# EAGLE design Schematic1 (EAGLE 8.4.2)
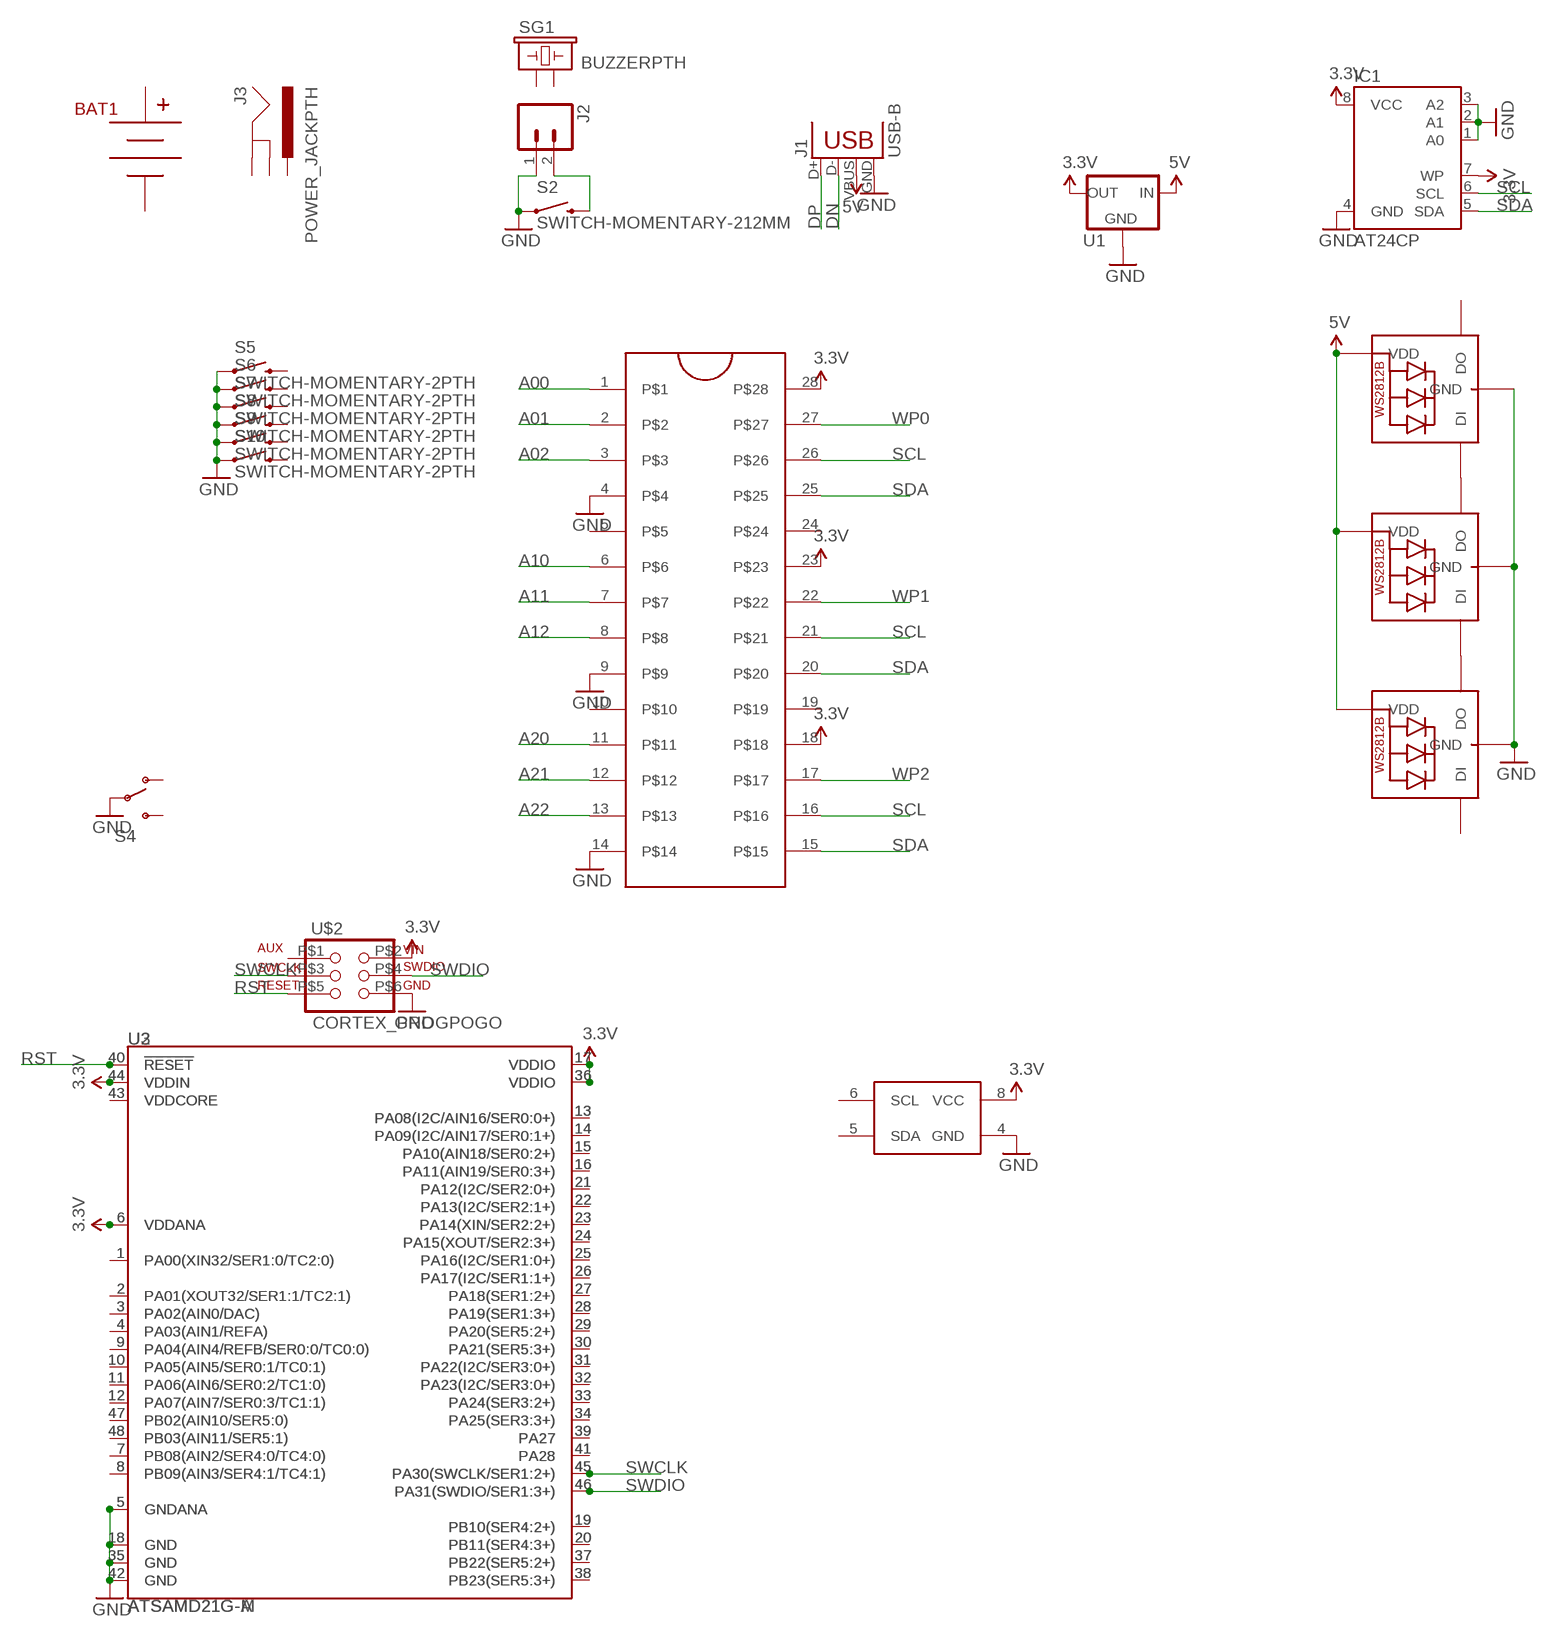
[diagram p0: schematic, sheet 1]

## Parts
BAT1  9VHOLDERCLIPS  [BSPC9V]
IC1  AT24CP  [DIL08]
J1  USB-B  USBPTH  [USB-B-PTH]
J2  M02PTH3  [1X02_LONGPADS]
J3  POWER_JACKPTH  [POWER_JACK_PTH]
LED1  WS2812B5050  [WS2812B]
LED2  WS2812B5050  [WS2812B]
LED3  WS2812B5050  [WS2812B]
S2  SWITCH-MOMENTARY-212MM  [TACTILE-PTH-12MM]
S4  SWITCH-SPDTPTH  [SWITCH-SPDT]
S5  SWITCH-MOMENTARY-2PTH  [TACTILE-PTH]
S6  SWITCH-MOMENTARY-2PTH  [TACTILE-PTH]
S7  SWITCH-MOMENTARY-2PTH  [TACTILE-PTH]
S8  SWITCH-MOMENTARY-2PTH  [TACTILE-PTH]
S9  SWITCH-MOMENTARY-2PTH  [TACTILE-PTH]
S10  SWITCH-MOMENTARY-2PTH  [TACTILE-PTH]
SG1  BUZZERPTH  [BUZZER-12MM]
U1  V_REG_78XXTO-92_UNTESTED  [TO-92]
U2  ATSAMD21G-A  [TQFP-48]
U3  ATSAMD21G-M  [QFN-48]
U4  ATSHA204_I2C-SSHDA-*  [SOIC-08]
U$1  ZIFSOCKET-28-3ZIFFSOCKET-28-3  [DIL28-3-ZIF_SOCKET]
U$2  CORTEX_PROGPOGO  [2X3_MAX]

## Nets
3.3V: IC1.7(WP) IC1.8(VCC) U1.1(OUT) U2.6(VDDANA) U2.17(VDDIO) U2.36(VDDIO) U2.44(VDDIN) U3.6(VDDANA) U3.17(VDDIO) U3.36(VDDIO) U3.44(VDDIN) U4.8(VCC) U$1.18 U$1.23 U$1.28 U$2.P$2(VIN)
5V: J1.VBUS LED1.1-VDD(VDD) LED2.1-VDD(VDD) LED3.1-VDD(VDD) U1.3(IN)
A00: U$1.1
A01: U$1.2
A02: U$1.3
A10: U$1.6
A11: U$1.7
A12: U$1.8
A20: U$1.11
A21: U$1.12
A22: U$1.13
DN: J1.D-
DP: J1.D+
GND: IC1.1(A0) IC1.2(A1) IC1.3(A2) IC1.4(GND) J1.GND J2.1 LED1.3-GND(GND) LED2.3-GND(GND) LED3.3-GND(GND) S2.1 S2.2 S4.2(P) S5.1 S5.2 S6.1 S6.2 S7.1 S7.2 S8.1 S8.2 S9.1 S9.2 S10.1 S10.2 U1.2(GND) U2.5(GNDANA) U2.18(GND) U2.35(GND) U2.42(GND) U3.5(GNDANA) U3.18(GND) U3.35(GND) U3.42(GND) U4.4(GND) U$1.4 U$1.9 U$1.14 U$2.P$6(GND)
N$1: LED1.4-DIN(DI) LED2.2-DOUT(DO)
N$2: LED2.4-DIN(DI) LED3.2-DOUT(DO)
N$4: U2.1(PA00(XIN32/SER1:0/TC2:0)) U3.1(PA00(XIN32/SER1:0/TC2:0))
N$5: U2.2(PA01(XOUT32/SER1:1/TC2:1)) U3.2(PA01(XOUT32/SER1:1/TC2:1))
N$6: U2.3(PA02(AIN0/DAC)) U3.3(PA02(AIN0/DAC))
N$7: U2.4(PA03(AIN1/REFA)) U3.4(PA03(AIN1/REFA))
N$8: U2.11(PA06(AIN6/SER0:2/TC1:0)) U3.11(PA06(AIN6/SER0:2/TC1:0))
N$10: U2.7(PB08(AIN2/SER4:0/TC4:0)) U3.7(PB08(AIN2/SER4:0/TC4:0))
N$11: U2.8(PB09(AIN3/SER4:1/TC4:1)) U3.8(PB09(AIN3/SER4:1/TC4:1))
N$12: U2.9(PA04(AIN4/REFB/SER0:0/TC0:0)) U3.9(PA04(AIN4/REFB/SER0:0/TC0:0))
N$13: U2.10(PA05(AIN5/SER0:1/TC0:1)) U3.10(PA05(AIN5/SER0:1/TC0:1))
N$14: U2.12(PA07(AIN7/SER0:3/TC1:1)) U3.12(PA07(AIN7/SER0:3/TC1:1))
N$15: U2.13(PA08(I2C/AIN16/SER0:0+)) U3.13(PA08(I2C/AIN16/SER0:0+))
N$16: U2.15(PA10(AIN18/SER0:2+)) U3.15(PA10(AIN18/SER0:2+))
N$17: U2.14(PA09(I2C/AIN17/SER0:1+)) U3.14(PA09(I2C/AIN17/SER0:1+))
N$18: U2.16(PA11(AIN19/SER0:3+)) U3.16(PA11(AIN19/SER0:3+))
N$19: J2.2 S2.3 S2.4
N$21: U2.20(PB11(SER4:3+)) U3.20(PB11(SER4:3+))
N$22: U2.19(PB10(SER4:2+)) U3.19(PB10(SER4:2+))
N$23: U2.21(PA12(I2C/SER2:0+)) U3.21(PA12(I2C/SER2:0+))
N$24: U2.22(PA13(I2C/SER2:1+)) U3.22(PA13(I2C/SER2:1+))
N$25: U2.23(PA14(XIN/SER2:2+)) U3.23(PA14(XIN/SER2:2+))
N$26: U2.24(PA15(XOUT/SER2:3+)) U3.24(PA15(XOUT/SER2:3+))
N$27: U2.25(PA16(I2C/SER1:0+)) U3.25(PA16(I2C/SER1:0+))
N$28: U2.26(PA17(I2C/SER1:1+)) U3.26(PA17(I2C/SER1:1+))
N$29: U2.27(PA18(SER1:2+)) U3.27(PA18(SER1:2+))
N$30: U2.28(PA19(SER1:3+)) U3.28(PA19(SER1:3+))
N$31: U2.29(PA20(SER5:2+)) U3.29(PA20(SER5:2+))
N$32: U2.30(PA21(SER5:3+)) U3.30(PA21(SER5:3+))
N$33: U2.31(PA22(I2C/SER3:0+)) U3.31(PA22(I2C/SER3:0+))
N$34: U2.32(PA23(I2C/SER3:0+)) U3.32(PA23(I2C/SER3:0+))
N$35: U2.33(PA24(SER3:2+)) U3.33(PA24(SER3:2+))
N$36: U2.34(PA25(SER3:3+)) U3.34(PA25(SER3:3+))
N$39: U2.37(PB22(SER5:2+)) U3.37(PB22(SER5:2+))
N$40: U2.38(PB23(SER5:3+)) U3.38(PB23(SER5:3+))
N$41: U2.39(PA27) U3.39(PA27)
N$43: U2.41(PA28) U3.41(PA28)
N$45: U2.43(VDDCORE) U3.43(VDDCORE)
N$49: U2.47(PB02(AIN10/SER5:0)) U3.47(PB02(AIN10/SER5:0))
N$50: U2.48(PB03(AIN11/SER5:1)) U3.48(PB03(AIN11/SER5:1))
RST: U2.40(!RESET!) U3.40(!RESET!) U$2.P$5(RST)
SCL: IC1.6(SCL) U$1.16 U$1.21 U$1.26
SDA: IC1.5(SDA) U$1.15 U$1.20 U$1.25
SWCLK: U2.45(PA30(SWCLK/SER1:2+)) U3.45(PA30(SWCLK/SER1:2+)) U$2.P$3(SWCLK)
SWDIO: U2.46(PA31(SWDIO/SER1:3+)) U3.46(PA31(SWDIO/SER1:3+)) U$2.P$4(SWDIO)
WP0: U$1.27
WP1: U$1.22
WP2: U$1.17
Unconnected: BAT1.P$1(V-) BAT1.P$2(V-) BAT1.P$3(V-) BAT1.P$4(V+) BAT1.P$5(V+) BAT1.P$6(V+) J3.GND J3.GNDBREAK J3.PWR LED1.2-DOUT(DO) LED3.4-DIN(DI) S4.1(O) S4.3(S) S5.3 S5.4 S6.3 S6.4 S7.3 S7.4 S8.3 S8.4 S9.3 S9.4 S10.3 S10.4 SG1.+ SG1.- U4.5(SDA) U4.6(SCL) U$1.5 U$1.10 U$1.19 U$1.24 U$2.P$1(AUX)

## Library data of the parts
BAT1 = maxorig:9VHOLDER: 9V board-mount battery cradle
IC1 = atmel:AT24C*: 2-wire serial EEPROM; MPN: AT24C1024BW-SH-B; OC_FARNELL: 1362646; OC_NEWARK: 03P2044
J1 = SparkFun-Connectors:USB: USB Connectors USB-B-PTH is fully proven SKU : PRT-00139/CONN-08278 USB-miniB is fully proven SKU : PRT-00587 USB-A-PCB is untested. USB-A-H is throughly reviewed, but untested. Spark Fun Electronics SKU : PRT-00437 USB-B-SMT is throughly reviewed, but untested. Needs silkscreen touching up. USB-A-S has not been used/tested USB-MB-H has not been used/tested USB-MICROB has been used. CONN-09505; PROD_ID: CONN-08278
J2 = SparkFun-Connectors:M02: Standard 2-pin 0.1" header. Use with - straight break away headers ( PRT-00116) - right angle break away headers (PRT-00553) - swiss pins (PRT-00743) - machine pins (PRT-00117) - female headers (PRT-00115) Molex polarized connector foot print use with: PRT-08233 with associated crimp pins and housings. 2.54_SCREWTERM for use with PRT-10571. 3.5mm Screw Terminal footprints for PRT-08084 5mm Screw Terminal footprints for use with PRT-08432
J3 = SparkFun-Connectors:POWER_JACK: Power Jack This is the standard 5.5mm barrel jack for power. The PTH is the most common, proven, reliable, footprint. The Slot footprint only works if the mill layer is transmitted to the PCB fab house so be warned. Mating wall wart : TOL-00298 (and others); PROD_ID: CONN-08197
LED1-LED3 = adafruit:WS2812B
S2 = maxorig:SWITCH-MOMENTARY-2: Various NO switches- pushbuttons, reed, etc; PROD_ID: SWCH-09185
S4 = SparkFun-Electromechanical:SWITCH-SPDT: SPDT Switch Simple slide switch, Spark Fun Electronics SKU : COM-00102 DPDT SMT slide switch, AYZ0202, SWCH-08179; PROD_ID: SWCH-08261
S5-S10 = maxorig:SWITCH-MOMENTARY-2: Various NO switches- pushbuttons, reed, etc; PROD_ID: SWCH-08441
SG1 = SparkFun-Electromechanical:BUZZER: Buzzer 12mm Spark Fun Electronics SKU : Comp-Buzzer
U1 = SparkFun-PowerIC:V_REG_78XX: Voltage Regulator Standard 78xx regulator. IGO (Input Ground Output). Spark Fun Electronics SKU : COM-00107
U2 U3 = SparkFun-DigitalIC:ATSAMD21G: Atmel SAMD21G SMART ARM-Based Microcontroller The Atmel ® | SMART ™ SAM D21 is a series of low-power microcontrollers using the 32-bit ARM ® Cortex ® -M0+ processor, and ranging from 32- to 64-pins with up to 256KB Flash and 32KB of SRAM. The SAM D21 devices operate at a maximum frequency of 48MHz and reach 2.46 CoreMark/MHz. They are designed for simple and intuitive migration with identical peripheral modules, hex compatible code, identical linear address map and pin compatible migration paths between all devices in the product series. All devices include intelligent and flexible peripherals, Atmel Event System for inter-peripheral signaling, and support for capacitive touch button, slider and wheel user interfaces.; PROD_ID: IC-13064
U4 = maxorig:ATSHA204_I2C: ATSHA204 I2C - Atmel Crypto Element w/ 4.5Kb EEPROM The Atmel ATSHA204 is an optimized authentication chip that includes a 4.5Kb EEPROM. This array can be used for storage of keys, miscellaneous read/write, read-only, password or secret data, and consumption tracking. Access to the various sections of memory can be restricted in a variety of ways and then the configuration locked to prevent changes. This part is for the I2C version of the ATSHA204A. Technical specifications: Supply voltage: 2.0-5.5V Communication voltage: 1.8-5.5V 512 bit OTP (One Time Programmable) region Guaranteed unique 72-bit serial number Internal, high-quality RNG (Random Number Generator) Hardware SHA-256 accelerator
U$1 = SparkFun-Connectors:ZIFSOCKET-28-3: Lever-action ZIF socket for 28-pin ICs
U$2 = maxorig:CORTEX_PROG: 2x3 0.1' connector for programming and debugging Cortex M0(+) MCUs Has auxiliary pin broken out for extra testing functionality

## Board
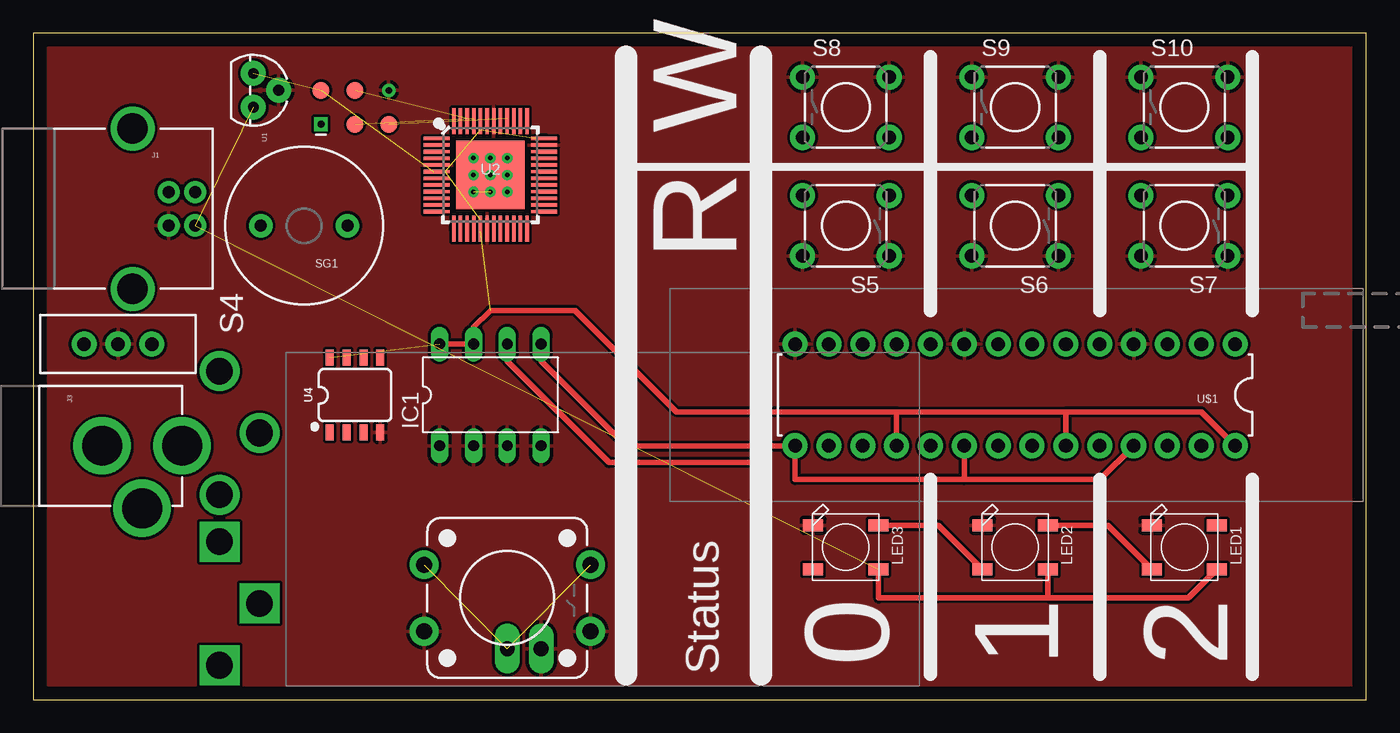
[diagram p1: board, top side]
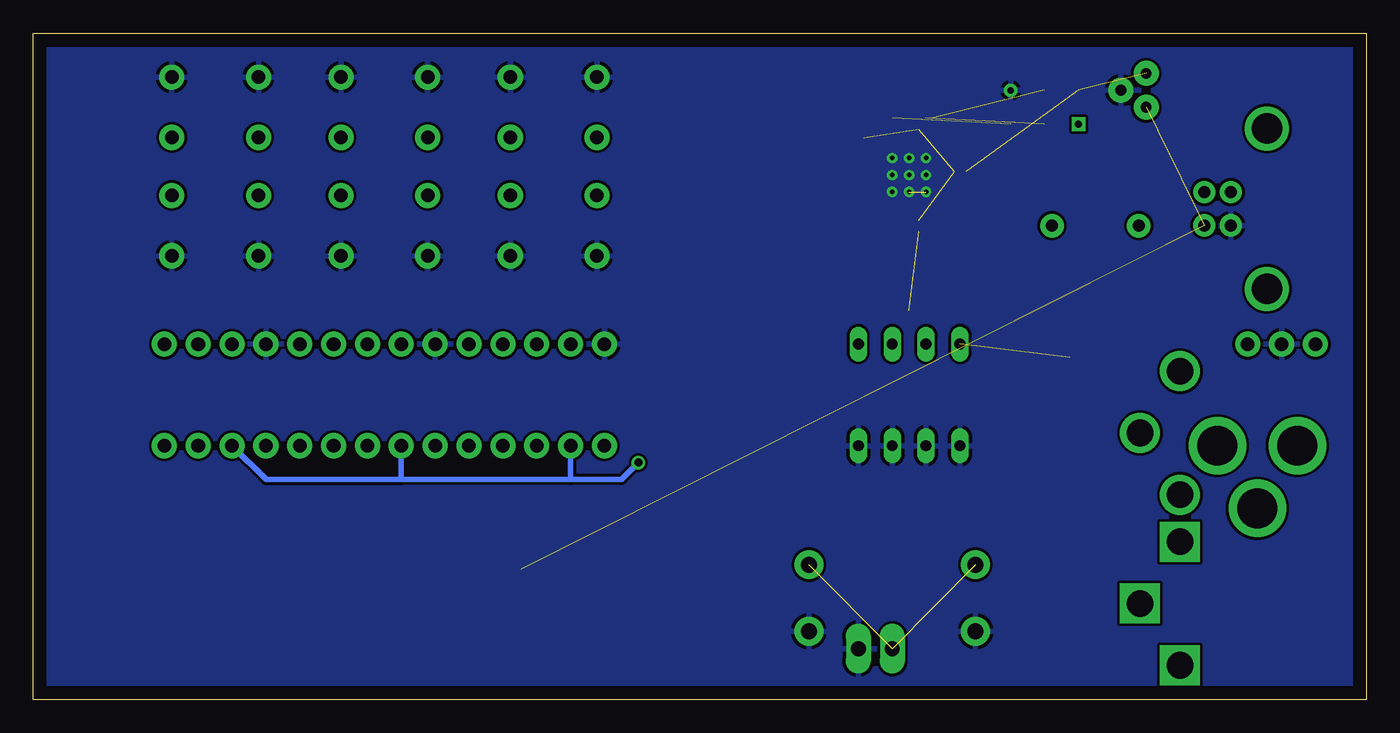
[diagram p2: board, bottom side, seen from below]

Size 100 x 50 mm. Coordinates in mm from the lower left corner, seen from the top.
Outline: 0,0 100,0 100,50 0,50 0,0
Copper layers (1*16): Top 0.035mm / dielectric 1.5mm / Bottom 0.035mm
Design rules "default": minimum track width 10mil, minimum drill 24mil, track to track 8mil, track to pad 8mil, pad to pad 8mil, via to via 8mil, smd to smd 8mil, copper to edge 40mil, drill to drill 8mil, minimum pad ring 10mil, minimum via ring 8mil, stop-mask expansion 4mil, vias tented up to drill 0mil, thermal gap 10mil

### Footprints (pad centres in the part's own frame; a part is rotated, then mirrored left to right if it is on the bottom)
BSPC9V = drill 2: P$1 0,22.1; P$2 0,12.83; P$3 3,17.465 | drill 2 square: P$4 0,9.3; P$5 0,0.03; P$6 3,4.665
DIL08 = drill 0.813 long: 1 -3.81,-3.81; 2 -1.27,-3.81; 3 1.27,-3.81; 4 3.81,-3.81; 5 3.81,3.81; 6 1.27,3.81; 7 -1.27,3.81; 8 -3.81,3.81
USB-B-PTH = drill 0.914 pad 1.676: D+ 0,1.25; D- 1.981,1.25; GND 0,-1.25; VBUS 1.981,-1.25 | drill 2.286: S1 -2.718,-6.02; S2 -2.718,6.02
1X02_LONGPADS = drill 1.118 pad 1.88 long: 1 0,0; 2 2.54,0
POWER_JACK_PTH = drill 2.997 pad 4.318: GND 0,7.7; GNDBREAK 4.7,10.7; PWR 0,13.7
WS2812B = smd 1.5 x 0.9: 1-VDD 2.45,-1.65; 2-DOUT 2.45,1.65; 3-GND -2.45,1.65; 4-DIN -2.45,-1.65
TACTILE-PTH-12MM = drill 1.2 pad 2.159: 1 6.25,-2.5; 2 -6.25,-2.5; 3 6.25,2.5; 4 -6.25,2.5
SWITCH-SPDT = drill 1.016 pad 1.88: 1 0,2.54; 2 0,0; 3 0,-2.54
TACTILE-PTH = drill 1.016 pad 1.88: 1 -3.251,2.261; 2 3.251,2.261; 3 -3.251,-2.261; 4 3.251,-2.261
BUZZER-12MM = drill 0.9 pad 1.778: + 3.25,0; - -3.25,0
TO-92 = drill 0.813 pad 1.88: 1 -1.27,0; 2 0,1.905; 3 1.27,0
TQFP-48 = smd 1.5 x 0.28: 1 -4.25,2.75; 2 -4.25,2.25; 3 -4.25,1.75; 4 -4.25,1.25; 5 -4.25,0.75; 6 -4.25,0.25; 7 -4.25,-0.25; 8 -4.25,-0.75; 9 -4.25,-1.25; 10 -4.25,-1.75; 11 -4.25,-2.25; 12 -4.25,-2.75; 25 4.25,-2.75; 26 4.25,-2.25; 27 4.25,-1.75; 28 4.25,-1.25; 29 4.25,-0.75; 30 4.25,-0.25; 31 4.25,0.25; 32 4.25,0.75; 33 4.25,1.25; 34 4.25,1.75; 35 4.25,2.25; 36 4.25,2.75 | smd 0.28 x 1.5: 13 -2.75,-4.25; 14 -2.25,-4.25; 15 -1.75,-4.25; 16 -1.25,-4.25; 17 -0.75,-4.25; 18 -0.25,-4.25; 19 0.25,-4.25; 20 0.75,-4.25; 21 1.25,-4.25; 22 1.75,-4.25; 23 2.25,-4.25; 24 2.75,-4.25; 37 2.75,4.25; 38 2.25,4.25; 39 1.75,4.25; 40 1.25,4.25; 41 0.75,4.25; 42 0.25,4.25; 43 -0.25,4.25; 44 -0.75,4.25; 45 -1.25,4.25; 46 -1.75,4.25; 47 -2.25,4.25; 48 -2.75,4.25
QFN-48 = smd 0.7 x 0.25: 1 -3.4,2.75; 2 -3.4,2.25; 3 -3.4,1.75; 4 -3.4,1.25; 5 -3.4,0.75; 6 -3.4,0.25; 7 -3.4,-0.25; 8 -3.4,-0.75; 9 -3.4,-1.25; 10 -3.4,-1.75; 11 -3.4,-2.25; 12 -3.4,-2.75; 25 3.4,-2.75; 26 3.4,-2.25; 27 3.4,-1.75; 28 3.4,-1.25; 29 3.4,-0.75; 30 3.4,-0.25; 31 3.4,0.25; 32 3.4,0.75; 33 3.4,1.25; 34 3.4,1.75; 35 3.4,2.25; 36 3.4,2.75 | smd 0.25 x 0.7: 13 -2.75,-3.4; 14 -2.25,-3.4; 15 -1.75,-3.4; 16 -1.25,-3.4; 17 -0.75,-3.4; 18 -0.25,-3.4; 19 0.25,-3.4; 20 0.75,-3.4; 21 1.25,-3.4; 22 1.75,-3.4; 23 2.25,-3.4; 24 2.75,-3.4; 37 2.75,3.4; 38 2.25,3.4; 39 1.75,3.4; 40 1.25,3.4; 41 0.75,3.4; 42 0.25,3.4; 43 -0.25,3.4; 44 -0.75,3.4; 45 -1.25,3.4; 46 -1.75,3.4; 47 -2.25,3.4; 48 -2.75,3.4 | smd 5.15 x 5.15: EP 0,0
SOIC-08 = smd 0.6 x 1.2: 1 -1.905,-2.8; 2 -0.635,-2.8; 3 0.635,-2.8; 4 1.905,-2.8; 5 1.905,2.8; 6 0.635,2.8; 7 -0.635,2.8; 8 -1.905,2.8
DIL28-3-ZIF_SOCKET = drill 1.016 pad 1.88: 1 -16.51,-3.81; 2 -13.97,-3.81; 3 -11.43,-3.81; 4 -8.89,-3.81; 5 -6.35,-3.81; 6 -3.81,-3.81; 7 -1.27,-3.81; 8 1.27,-3.81; 9 3.81,-3.81; 10 6.35,-3.81; 11 8.89,-3.81; 12 11.43,-3.81; 13 13.97,-3.81; 14 16.51,-3.81; 15 16.51,3.81; 16 13.97,3.81; 17 11.43,3.81; 18 8.89,3.81; 19 6.35,3.81; 20 3.81,3.81; 21 1.27,3.81; 22 -1.27,3.81; 23 -3.81,3.81; 24 -6.35,3.81; 25 -8.89,3.81; 26 -11.43,3.81; 27 -13.97,3.81; 28 -16.51,3.81
2X3_MAX = drill 0.508 square: P$1 -2.54,-1.27 | smd 1.27 x 1.27: P$2 -2.54,1.27; P$3 0,-1.27; P$4 0,1.27; P$5 2.54,-1.27 | drill 0.508: P$6 2.54,1.27

### Placement (x,y rotation side)
BAT1  13.97,2.54 0 top
IC1  34.29,22.86 0 top
J1  10.16,36.83 0 top
J2  38.1,3.81 180 top
J3  -2.54,19.05 270 top
LED1  86.36,11.43 0 top
LED2  73.66,11.43 0 top
LED3  60.96,11.43 0 top
S2  35.56,7.62 0 top
S4  6.35,26.67 270 top
S5  60.96,35.56 180 top
S6  73.66,35.56 180 top
S7  86.36,35.56 180 top
S8  60.96,44.45 0 top
S9  73.66,44.45 0 top
S10  86.36,44.45 0 top
SG1  20.32,35.56 180 top
U1  16.51,45.72 270 top
U2  34.29,39.37 0 top
U3  34.29,39.37 0 top
U4  24.13,22.86 0 top
U$1  73.66,22.86 180 top
U$2  24.13,44.45 0 top

### Tracks (layer width: path | path; a pad name or v marks a point on that pad's centre or on a via)
3.3V  (7 unrouted)
  Top 0.254: U2.36 U3.36 | U3.17 U2.17 | U2.6 U3.6 | U3.44 U2.44
  Top 0.406: U$1.28 87.63,21.59 77.47,21.59 | 77.47,21.59 U$1.23 | 64.77,21.59 77.47,21.59 | 64.77,21.59 48.26,21.59 40.64,29.21 34.29,29.21 33.02,27.94 IC1.7 IC1.8 | U$1.18 64.77,21.59
5V  (2 unrouted)
  Top 0.406: LED1.1-VDD 86.65,7.62 76.2,7.62 | 76.2,7.62 63.41,7.62 LED3.1-VDD | LED2.1-VDD 76.11,7.71 76.2,7.62
GND  (via drill 0.35)  (1 unrouted)
  Top 0.254: U2.35 U3.35
  other vias: 34.29,39.37 33.02,39.37 33.02,40.64 34.29,40.64 35.56,40.64 35.56,39.37 35.56,38.1 34.29,38.1 33.02,38.1
  pour Bottom: 0,0 100.33,0 100.33,49.53 0,49.53
  pour Top: 100.33,0 0,0 0,50.8 100.33,50.8
N$1
  Top 0.406: LED2.2-DOUT 80.61,13.08 LED1.4-DIN
N$2
  Top 0.406: LED3.2-DOUT 67.91,13.08 LED2.4-DIN
N$4
  Top 0.254: U2.1 U3.1
N$5
  Top 0.254: U2.2 U3.2
N$6
  Top 0.254: U2.3 U3.3
N$7
  Top 0.254: U2.4 U3.4
N$8
  Top 0.254: U3.11 U2.11
N$10
  Top 0.254: U2.7 U3.7
N$11
  Top 0.254: U2.8 U3.8
N$12
  Top 0.254: U3.9 U2.9
N$13
  Top 0.254: U2.10 U3.10
N$14
  Top 0.254: U2.12 U3.12
N$15
  Top 0.254: U2.13 U3.13
N$16
  Top 0.254: U2.15 U3.15
N$17
  Top 0.254: U2.14 U3.14
N$18
  Top 0.254: U2.16 U3.16
N$19  (2 unrouted)
N$21
  Top 0.254: U2.20 U3.20
N$22
  Top 0.254: U2.19 U3.19
N$23
  Top 0.254: U2.21 U3.21
N$24
  Top 0.254: U2.22 U3.22
N$25
  Top 0.254: U2.23 U3.23
N$26
  Top 0.254: U2.24 U3.24
N$27
  Top 0.254: U2.25 U3.25
N$28
  Top 0.254: U2.26 U3.26
N$29
  Top 0.254: U2.27 U3.27
N$30
  Top 0.254: U2.28 U3.28
N$31
  Top 0.254: U2.29 U3.29
N$32
  Top 0.254: U2.30 U3.30
N$33
  Top 0.254: U2.31 U3.31
N$34
  Top 0.254: U2.32 U3.32
N$35
  Top 0.254: U2.33 U3.33
N$36
  Top 0.254: U2.34 U3.34
N$39
  Top 0.254: U3.37 U2.37
N$40
  Top 0.254: U3.38 U2.38
N$41
  Top 0.254: U3.39 U2.39
N$43
  Top 0.254: U3.41 U2.41
N$45
  Top 0.254: U3.43 U2.43
N$49
  Top 0.254: U3.47 U2.47
N$50
  Top 0.254: U2.48 U3.48
RST  (1 unrouted)
  Top 0.254: U3.40 U2.40
SCL  (via drill 0.6)
  Top 0.406: IC1.6 35.56,25.4 43.18,17.78 v54.61,17.78
  Bottom 0.406: 72.39,16.51 82.55,16.51 U$1.26 | U$1.21 72.39,16.51 | 59.69,16.51 72.39,16.51 | U$1.16 59.69,16.51 | v54.61,17.78 55.88,16.51 59.69,16.51
SDA
  Top 0.406: 69.85,16.51 80.01,16.51 U$1.25 | 69.85,16.51 U$1.20 | 69.85,16.51 57.15,16.51 U$1.15 44.45,19.05 38.1,25.4 IC1.5
SWCLK  (1 unrouted)
  Top 0.254: U3.45 U2.45
SWDIO  (1 unrouted)
  Top 0.254: U3.46 U2.46

### Text on the board
tPlace: W | R | 0 | 1 | 2 | Status